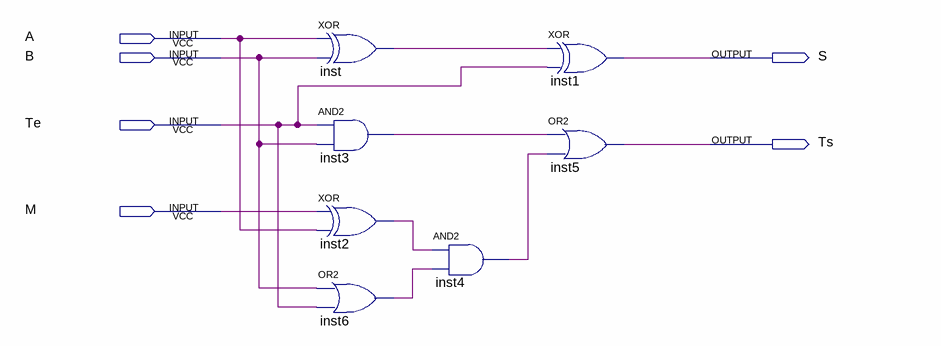
[diagram p0: schematic sheet]
// Quartus schematic somador_subtrator_completo.bdf as structural Verilog: 7 symbols, 6 pins
module somador_subtrator_completo (
  input  A,
  input  B,
  input  Te,
  input  M,
  output S,
  output Ts
);

  wire inst2_out, inst3_out, inst4_out, inst6_out, inst_out;

  xor inst (inst_out, A, B);
  and inst3 (inst3_out, Te, B);
  xor inst2 (inst2_out, M, A);
  or inst6 (inst6_out, B, Te);
  and inst4 (inst4_out, inst2_out, inst6_out);
  xor inst1 (S, inst_out, Te);
  or inst5 (Ts, inst3_out, inst4_out);
endmodule
